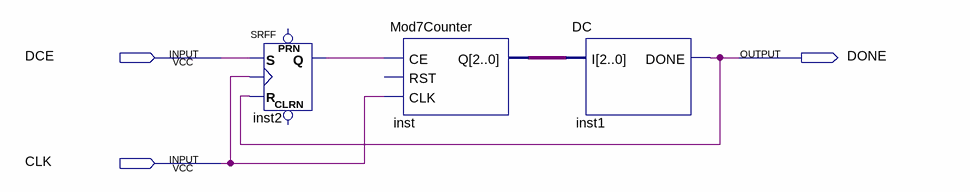
[diagram p0: schematic sheet]
// Quartus schematic DONECHECK.bdf as structural Verilog: 3 symbols, 3 pins
module DONECHECK (
  input  DCE,
  input  CLK,
  output DONE
);

  wire inst2_q;
  wire [2:0] inst_q;

  SRFF inst2 (.S(DCE), .R(DONE), .CLK(CLK), .Q(inst2_q));  // open: PRN, CLRN
  Mod7Counter inst (.CE(inst2_q), .CLK(CLK), .Q(inst_q));  // open: RST
  DC inst1 (.I(inst_q), .DONE(DONE));
endmodule
